# EAGLE design UniAdapter (EAGLE 7.0.0)
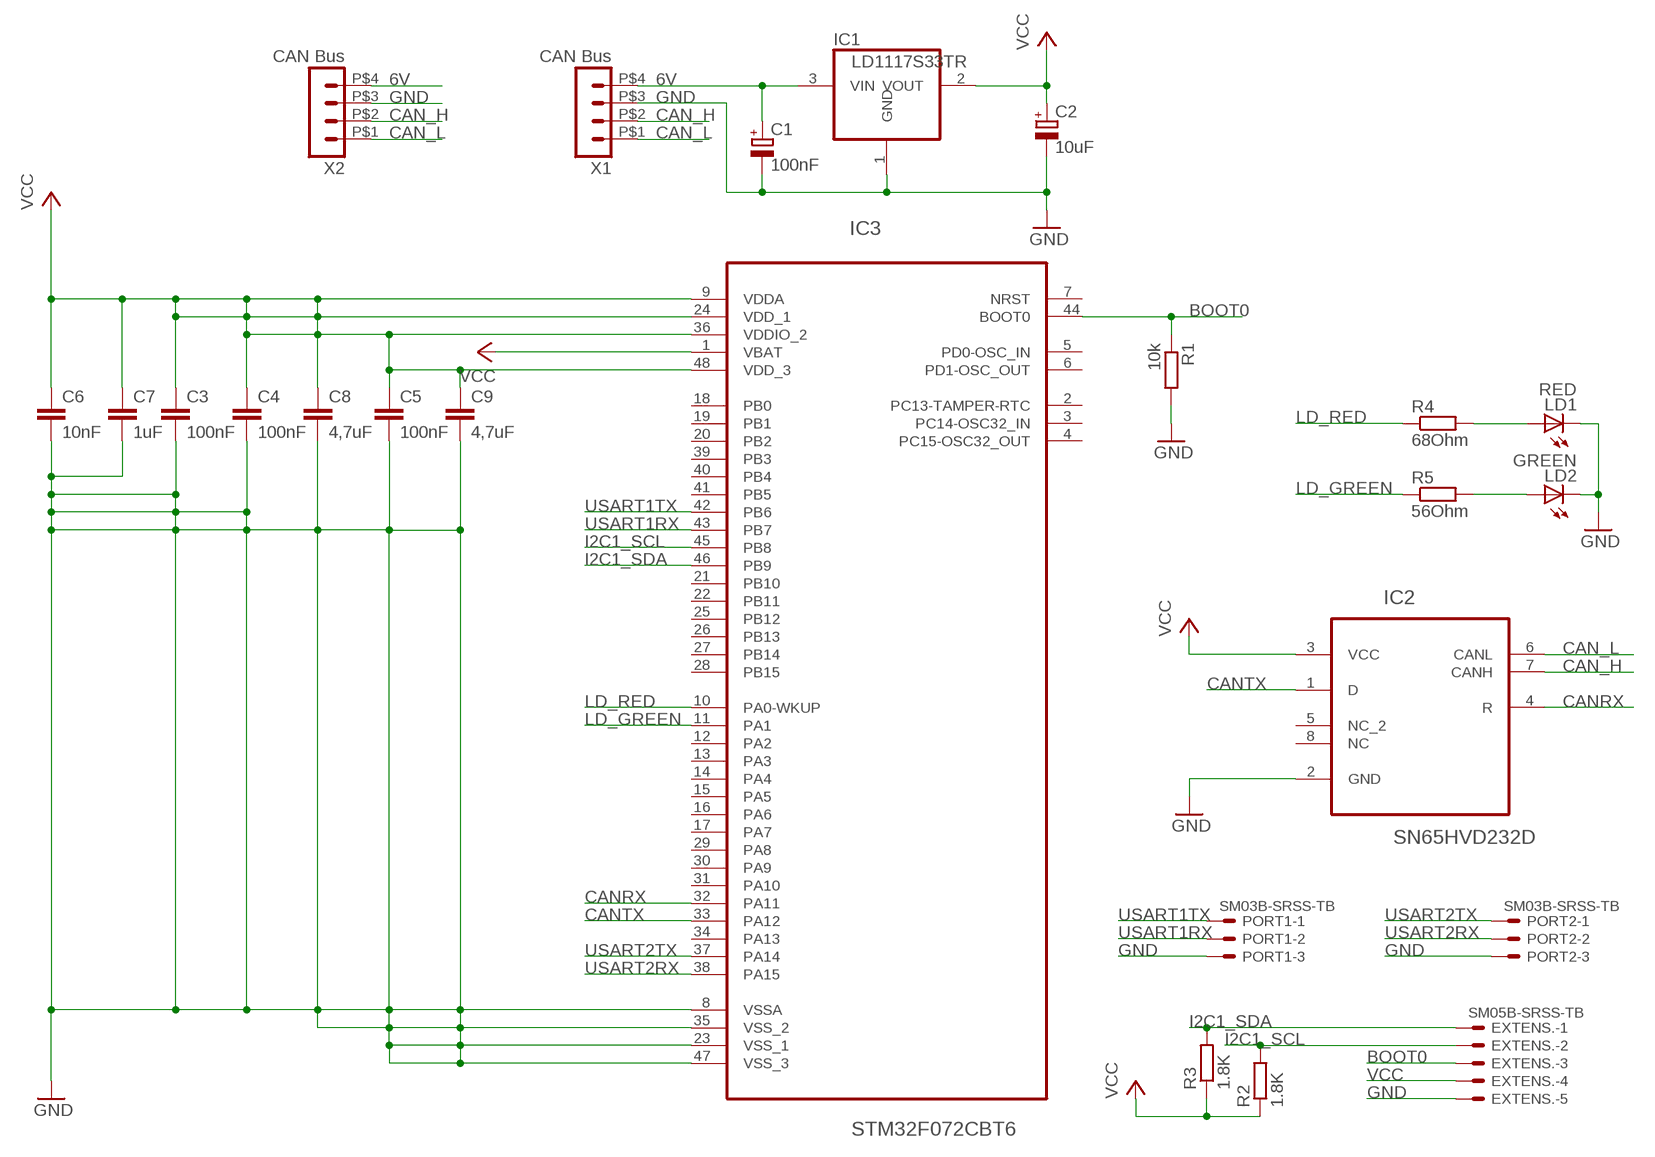
[diagram p0: schematic, sheet 1]

## Parts
C1  100nF  CPOL-EUCT3216  [CT3216]
C2  10uF  CPOL-EUCT3216  [CT3216]
C3  100nF  C-EUC0603  [C0603]
C4  100nF  C-EUC0603  [C0603]
C5  100nF  C-EUC0603  [C0603]
C6  10nF  C-EUC0603  [C0603]
C7  1uF  C-EUC0603  [C0603]
C8  4,7uF  C-EUC0603  [C0603]
C9  4,7uF  C-EUC0603  [C0603]
EXTENS.  SM05B-SRSS-TB  [SM05B-SRSS-TB]
IC1  LD1117S33TR  [SOT223]
IC2  SN65HVD232D  [SOIC127P600X175-8N]
IC3  STM32F072CBT6  [LQFP48]
LD1  RED  LEDCHIPLED_0603  [CHIPLED_0603]
LD2  GREEN  LEDCHIPLED_0603  [CHIPLED_0603]
PORT1  SM03B-SRSS-TB  [SM03B-SRSS-TB]
PORT2  SM03B-SRSS-TB  [SM03B-SRSS-TB]
R1  10k  R-EU_R0603  [R0603]
R2  1.8K  R-EU_R0603  [R0603]
R3  1.8K  R-EU_R0603  [R0603]
R4  68Ohm  R-EU_R0603  [R0603]
R5  56Ohm  R-EU_R0603  [R0603]
X1  CAN Bus  HEADER_POS4_43650-0412  [43650-0412]
X2  CAN Bus  HEADER_POS4_43650-0412  [43650-0412]

## Nets
6V: C1.+ IC1.3(VIN) X1.P$4 X2.P$4
BOOT0: EXTENS..3 IC3.44(BOOT0) R1.1
CAN_H: IC2.7(CANH) X1.P$2 X2.P$2
CAN_L: IC2.6(CANL) X1.P$1 X2.P$1
CANRX: IC2.4(R) IC3.32(PA11)
CANTX: IC2.1(D) IC3.33(PA12)
GND: C1.- C2.- C3.2 C4.2 C5.2 C6.2 C7.2 C8.2 C9.2 EXTENS..5 IC1.1(GND) IC2.2(GND) IC3.8(VSSA) IC3.23(VSS_1) IC3.35(VSS_2) IC3.47(VSS_3) LD1.C LD2.C PORT1.3 PORT2.3 R1.2 X1.P$3 X2.P$3
I2C1_SCL: EXTENS..2 IC3.45(PB8) R2.2
I2C1_SDA: EXTENS..1 IC3.46(PB9) R3.2
LD_GREEN: IC3.11(PA1) R5.1
LD_RED: IC3.10(PA0-WKUP) R4.1
N$3: LD1.A R4.2
N$4: LD2.A R5.2
USART1RX: IC3.43(PB7) PORT1.2
USART1TX: IC3.42(PB6) PORT1.1
USART2RX: IC3.38(PA15) PORT2.2
USART2TX: IC3.37(PA14) PORT2.1
VCC: C2.+ C3.1 C4.1 C5.1 C6.1 C7.1 C8.1 C9.1 EXTENS..4 IC1.2(VOUT) IC2.3(VCC) IC3.1(VBAT) IC3.9(VDDA) IC3.24(VDD_1) IC3.36(VDDIO_2) IC3.48(VDD_3) R2.1 R3.1
Unconnected: IC2.5(NC_2) IC2.8(NC) IC3.2(PC13-TAMPER-RTC) IC3.3(PC14-OSC32_IN) IC3.4(PC15-OSC32_OUT) IC3.5(PD0-OSC_IN) IC3.6(PD1-OSC_OUT) IC3.7(NRST) IC3.12(PA2) IC3.13(PA3) IC3.14(PA4) IC3.15(PA5) IC3.16(PA6) IC3.17(PA7) IC3.18(PB0) IC3.19(PB1) IC3.20(PB2) IC3.21(PB10) IC3.22(PB11) IC3.25(PB12) IC3.26(PB13) IC3.27(PB14) IC3.28(PB15) IC3.29(PA8) IC3.30(PA9) IC3.31(PA10) IC3.34(PA13) IC3.39(PB3) IC3.40(PB4) IC3.41(PB5)

## Library data of the parts
C1 = rcl:CPOL-EU: POLARIZED CAPACITOR, European symbol; OC_FARNELL: 1190132
C2 = rcl:CPOL-EU: POLARIZED CAPACITOR, European symbol; OC_FARNELL: 1432447
C3-C5 = rcl:C-EU: CAPACITOR, European symbol; OC_FARNELL: 1759016
C6 = rcl:C-EU: CAPACITOR, European symbol; OC_FARNELL: 1759022
C7 = rcl:C-EU: CAPACITOR, European symbol; OC_FARNELL: 1759399
C8 C9 = rcl:C-EU: CAPACITOR, European symbol; OC_FARNELL: 2320811
EXTENS. = con-jst2:?M05B-SRSS-TB: Disconnectable Crimp style connector, 1.0mm pitch 5 contacts; OC_FARNELL: 1679121
IC1 = LD1117:LD1117S33TR: 800mA Low Dropout (LDO) Positive Regulator Fixed output voltage of: 3.3V; MF: STMICROELECTRONICS; MPN: REG1117; OC_FARNELL: 1202826; OC_NEWARK: 14P6981
IC2 = texas:SN65HVD232D: 3.3-V CAN TRANSCEIVERS; MPN: SN65HVD232D; OC_FARNELL: 1103107; OC_NEWARK: 35K4890; PACKAGE: SOIC-8; SUPPLIER: Texas Instruments
IC3 = STM32F0:STM32F072CBT6: Entry-level ARM Cortex-M0 MCU with 128 Kbytes Flash, 48 MHz CPU, USB, CAN and CEC functions; MPN: STM32F072CBT6; OC_FARNELL: 2432094; OC_NEWARK: 11N8296; PACKAGE: QFP-48; SUPPLIER: STMICROELECTRONICS
LD1 = led:LED: LED OSRAM: - CHIPLED LG R971, LG N971, LY N971, LG Q971, LY Q971, LO R971, LY R971 LH N974, LH R974 LS Q976, LO Q976, LY Q976 LO Q996 - Hyper CHIPLED LW Q18S LB Q993, LB Q99A, LB R99A - SideLED LS A670, LO A670, LY A670, LG A670, LP A670 LB A673, LV A673, LT A673, LW A673 LH A674 LY A675 LS A676, LA A676, LO A676, LY A676, LW A676 LS A679, LY A679, LG A679 - Hyper Micro SIDELED® LS Y876, LA Y876, LO Y876, LY Y876 LT Y87S - SmartLED LW L88C, LW L88S LB L89C, LB L89S, LG L890 LS L89K, LO L89K, LY L89K LS L896, LA L896, LO L896, LY L896 - TOPLED LS T670, LO T670, LY T670, LG T670, LP T670 LSG T670, LSP T670, LSY T670, LOP T670, LYG T670 LG T671, LOG T671, LSG T671 LB T673, LV T673, LT T673, LW T673 LH T674 LS T676, LA T676, LO T676, LY T676, LB T676, LH T676, LSB T676, LW T676 LB T67C, LV T67C, LT T67C, LS T67K, LO T67K, LY T67K, LW E67C LS E67B, LA E67B, LO E67B, LY E67B, LB E67C, LV E67C, LT E67C LW T67C LS T679, LY T679, LG T679 LS T770, LO T770, LY T770, LG T770, LP T770 LB T773, LV T773, LT T773, LW T773 LH T774 LS E675, LA E675, LY E675, LS T675 LS T776, LA T776, LO T776, LY T776, LB T776 LHGB T686 LT T68C, LB T68C - Hyper Mini TOPLED® LB M676 - Mini TOPLED Santana® LG M470 LS M47K, LO M47K, LY M47K Source: http://www.osram.convergy.de LUXEON: - LUMILED® LXK2-PW12-R00, LXK2-PW12-S00, LXK2-PW14-U00, LXK2-PW14-V00 LXK2-PM12-R00, LXK2-PM12-S00, LXK2-PM14-U00 LXK2-PE12-Q00, LXK2-PE12-R00, LXK2-PE12-S00, LXK2-PE14-T00, LXK2-PE14-U00 LXK2-PB12-K00, LXK2-PB12-L00, LXK2-PB12-M00, LXK2-PB14-N00, LXK2-PB14-P00, LXK2-PB14-Q00 LXK2-PR12-L00, LXK2-PR12-M00, LXK2-PR14-Q00, LXK2-PR14-R00 LXK2-PD12-Q00, LXK2-PD12-R00, LXK2-PD12-S00 LXK2-PH12-R00, LXK2-PH12-S00 LXK2-PL12-P00, LXK2-PL12-Q00, LXK2-PL12-R00 Source: www.luxeon.com KINGBRIGHT: KA-3528ASYC Source: www.kingbright.com; OC_FARNELL: 2099221
LD2 = led:LED: LED OSRAM: - CHIPLED LG R971, LG N971, LY N971, LG Q971, LY Q971, LO R971, LY R971 LH N974, LH R974 LS Q976, LO Q976, LY Q976 LO Q996 - Hyper CHIPLED LW Q18S LB Q993, LB Q99A, LB R99A - SideLED LS A670, LO A670, LY A670, LG A670, LP A670 LB A673, LV A673, LT A673, LW A673 LH A674 LY A675 LS A676, LA A676, LO A676, LY A676, LW A676 LS A679, LY A679, LG A679 - Hyper Micro SIDELED® LS Y876, LA Y876, LO Y876, LY Y876 LT Y87S - SmartLED LW L88C, LW L88S LB L89C, LB L89S, LG L890 LS L89K, LO L89K, LY L89K LS L896, LA L896, LO L896, LY L896 - TOPLED LS T670, LO T670, LY T670, LG T670, LP T670 LSG T670, LSP T670, LSY T670, LOP T670, LYG T670 LG T671, LOG T671, LSG T671 LB T673, LV T673, LT T673, LW T673 LH T674 LS T676, LA T676, LO T676, LY T676, LB T676, LH T676, LSB T676, LW T676 LB T67C, LV T67C, LT T67C, LS T67K, LO T67K, LY T67K, LW E67C LS E67B, LA E67B, LO E67B, LY E67B, LB E67C, LV E67C, LT E67C LW T67C LS T679, LY T679, LG T679 LS T770, LO T770, LY T770, LG T770, LP T770 LB T773, LV T773, LT T773, LW T773 LH T774 LS E675, LA E675, LY E675, LS T675 LS T776, LA T776, LO T776, LY T776, LB T776 LHGB T686 LT T68C, LB T68C - Hyper Mini TOPLED® LB M676 - Mini TOPLED Santana® LG M470 LS M47K, LO M47K, LY M47K Source: http://www.osram.convergy.de LUXEON: - LUMILED® LXK2-PW12-R00, LXK2-PW12-S00, LXK2-PW14-U00, LXK2-PW14-V00 LXK2-PM12-R00, LXK2-PM12-S00, LXK2-PM14-U00 LXK2-PE12-Q00, LXK2-PE12-R00, LXK2-PE12-S00, LXK2-PE14-T00, LXK2-PE14-U00 LXK2-PB12-K00, LXK2-PB12-L00, LXK2-PB12-M00, LXK2-PB14-N00, LXK2-PB14-P00, LXK2-PB14-Q00 LXK2-PR12-L00, LXK2-PR12-M00, LXK2-PR14-Q00, LXK2-PR14-R00 LXK2-PD12-Q00, LXK2-PD12-R00, LXK2-PD12-S00 LXK2-PH12-R00, LXK2-PH12-S00 LXK2-PL12-P00, LXK2-PL12-Q00, LXK2-PL12-R00 Source: www.luxeon.com KINGBRIGHT: KA-3528ASYC Source: www.kingbright.com; OC_FARNELL: 2099223
PORT1 PORT2 = con-jst2:?M03B-SRSS-TB: Disconnectable Crimp style connector, 1.0mm pitch 3 contacts; OC_FARNELL: 1679118
R1 = rcl:R-EU_: RESISTOR, European symbol; OC_FARNELL: 2059627
R2 R3 = rcl:R-EU_: RESISTOR, European symbol; OC_FARNELL: 2059608
R4 = rcl:R-EU_: RESISTOR, European symbol; OC_FARNELL: 2059570
R5 = rcl:R-EU_: RESISTOR, European symbol; OC_FARNELL: 2059568
X1 X2 = con-molex-micro-fit-3_0:HEADER_POS4_?: Molex - Micro-Fit 3.0 Series connector, 3.00mm (0.118") pitch header, 4 positions.; OC_FARNELL: 2060684

## Net classes
0 default: clearance 0.205 mm

## Board
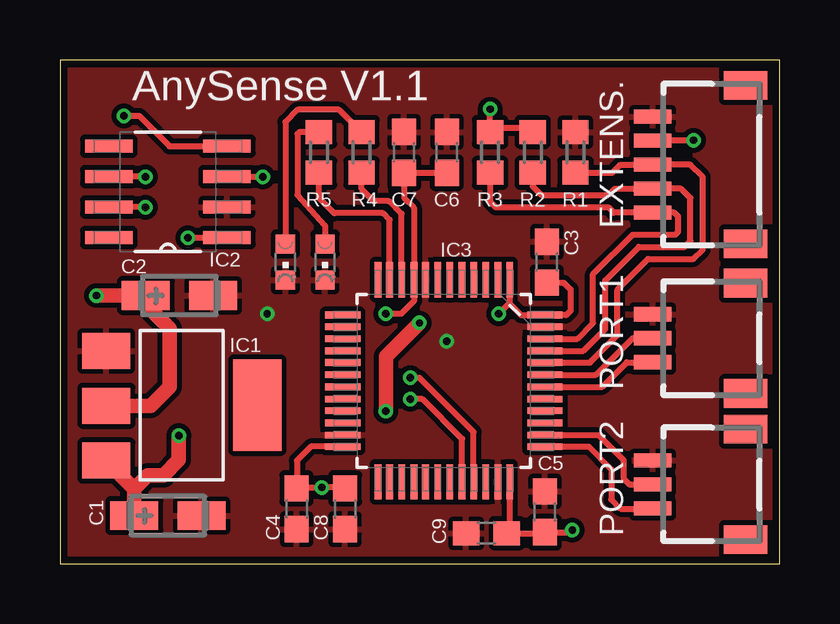
[diagram p1: board, top side]
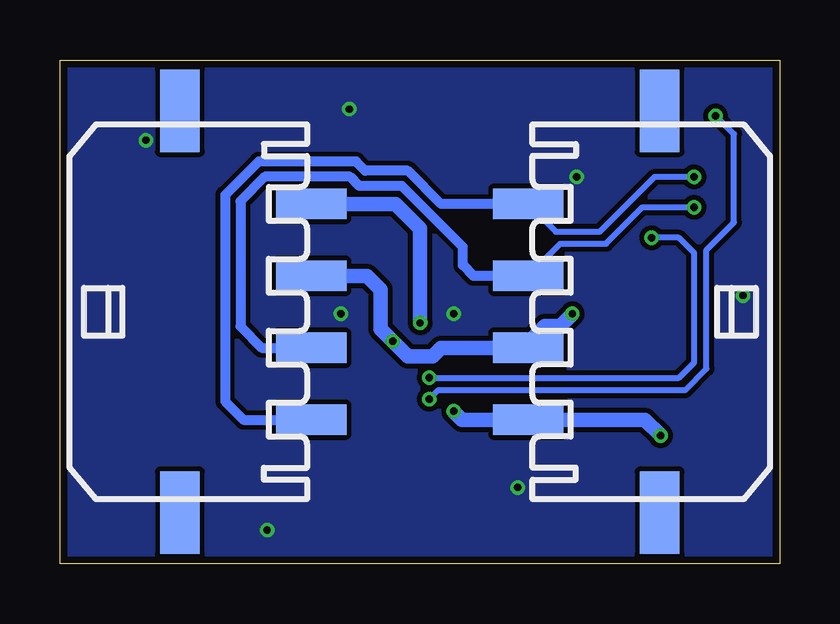
[diagram p2: board, bottom side, seen from below]

Size 30 x 21 mm. Coordinates in mm from the lower left corner, seen from the top.
Outline: 0,0 30,0 30,21 0,21 0,0
Copper layers (1*16): Top 0.035mm / dielectric 1.5mm / Bottom 0.035mm
Design rules "PCB-POOL Standard *": minimum track width 0.15mm, minimum drill 0.3mm, track to track 0.15mm, track to pad 0.15mm, pad to pad 0.15mm, via to via 0.15mm, smd to smd 0.15mm, copper to edge 0.3mm, drill to drill 0.2mm, minimum pad ring 0.2mm, minimum via ring 0.15mm, stop-mask expansion 0.075mm, vias tented up to drill 0mil, thermal gap 0.2mm

### Footprints (pad centres in the part's own frame; a part is rotated, then mirrored left to right if it is on the bottom)
CT3216 = smd 2 x 1.2: + -1.4,0; - 1.4,0
C0603 = smd 1.1 x 1: 1 -0.85,0; 2 0.85,0
SM05B-SRSS-TB = smd 0.6 x 1.55: 1 -2,2.975; 2 -1,2.975; 3 0,2.975; 4 1,2.975; 5 2,2.975 | smd 1.2 x 1.8: FIT@1 -3.3,-0.9; FIT@2 3.3,-0.9
SOT223 = smd 1.499 x 2.007: 1 -2.261,-3.15; 2 0.025,-3.15; 3 2.311,-3.15 | smd 3.81 x 2.007: 4 0,3.15
SOIC127P600X175-8N = smd 1.981 x 0.559: 1 -2.464,1.905; 2 -2.464,0.635; 3 -2.464,-0.635; 4 -2.464,-1.905; 5 2.464,-1.905; 6 2.464,-0.635; 7 2.464,0.635; 8 2.464,1.905
LQFP48 = smd 1.473 x 0.279: 1 -4.216,2.743; 2 -4.216,2.261; 3 -4.216,1.753; 4 -4.216,1.245; 5 -4.216,0.762; 6 -4.216,0.254; 7 -4.216,-0.254; 8 -4.216,-0.762; 9 -4.216,-1.245; 10 -4.216,-1.753; 11 -4.216,-2.261; 12 -4.216,-2.743; 25 4.216,-2.743; 26 4.216,-2.261; 27 4.216,-1.753; 28 4.216,-1.245; 29 4.216,-0.762; 30 4.216,-0.254; 31 4.216,0.254; 32 4.216,0.762; 33 4.216,1.245; 34 4.216,1.753; 35 4.216,2.261; 36 4.216,2.743 | smd 0.279 x 1.473: 13 -2.743,-4.216; 14 -2.261,-4.216; 15 -1.753,-4.216; 16 -1.245,-4.216; 17 -0.762,-4.216; 18 -0.254,-4.216; 19 0.254,-4.216; 20 0.762,-4.216; 21 1.245,-4.216; 22 1.753,-4.216; 23 2.261,-4.216; 24 2.743,-4.216; 37 2.743,4.216; 38 2.261,4.216; 39 1.753,4.216; 40 1.245,4.216; 41 0.762,4.216; 42 0.254,4.216; 43 -0.254,4.216; 44 -0.762,4.216; 45 -1.245,4.216; 46 -1.753,4.216; 47 -2.261,4.216; 48 -2.743,4.216
CHIPLED_0603 = smd 0.8 x 0.8: A 0,-0.75; C 0,0.75
SM03B-SRSS-TB = smd 0.6 x 1.55: 1 -1,2.975; 2 0,2.975; 3 1,2.975 | smd 1.2 x 1.8: FIT@1 -2.3,-0.9; FIT@2 2.3,-0.9
R0603 = smd 1 x 1.1: 1 -0.85,0; 2 0.85,0
43650-0412 = smd 1.27 x 2.92: P$1 4.5,5.48; P$2 1.5,5.48; P$3 -1.5,5.48; P$4 -4.5,5.48 | smd 3.43 x 1.65: TAB1 8.38,0; TAB2 -8.38,0

### Placement (x,y rotation side)
C1  4.5,2 0 top
C2  4.98,11.18 0 top
C3  20.29,12.57 90 top
C4  9.86,2.29 270 top
C5  20.22,2.16 90 top
C6  16.13,17.14 90 top
C7  14.35,17.14 90 top
C8  11.89,2.29 270 top
C9  17.78,1.27 180 top
EXTENS.  27.69,16.64 90 top
IC1  5.08,6.6 270 top
IC2  4.5,15.5 180 top
IC3  16,7.62 270 top
LD1  9.4,12.57 180 top
LD2  11.05,12.57 180 top
PORT1  27.69,9.39 90 top
PORT2  27.69,3.3 90 top
R1  21.49,17.14 90 top
R2  19.71,17.14 270 top
R3  17.93,17.14 270 top
R4  12.57,17.14 90 top
R5  10.79,17.14 90 top
X1  5,10.5 90 bottom
X2  25,10.5 270 bottom

### Tracks (layer width: path | path; a pad name or v marks a point on that pad's centre or on a via)
6V  (via drill 0.3)
  Top 0.61: C1.+ 3.1,3.12 | 3.1,3.12 IC1.3 | v14.99,10.03 13.59,8.64 v13.59,6.35 | 3.1,3.12 3.66,3.68 4.32,3.68 4.95,4.32 v4.95,5.33
  Bottom 0.61: v4.95,5.33 5.62,6 X1.P$4 13.24,6 v13.59,6.35 | v14.99,10.03 14.99,13.97 16.02,15 X2.P$4
BOOT0
  Top 0.254: IC3.44 22.1,8.38 23.24,9.53 23.24,11.43 24.51,12.7 26.42,12.7 26.8,13.08 26.8,16.13 26.29,16.64 EXTENS..3 23.37,16.64 23.03,16.3 R1.1
CAN_H  (via drill 0.3)
  Top 0.254: v3.56,14.86 v3.55,14.87 IC2.7
  Bottom 0.254: X1.P$2 9.14,13.34 7.24,13.34 5.71,14.86 v3.56,14.86
  Bottom 0.406: X1.P$2 12.76,12 13.21,12.45 13.21,13.21 15.75,15.75 17.53,15.75 17.91,16.13 21.46,16.13 22.48,15.11 22.48,9.89 21.59,9 X2.P$2
CAN_L  (via drill 0.3)
  Top 0.254: v3.56,16.13 IC2.6
  Bottom 0.254: X1.P$1 9.32,13.84 7.49,13.84 5.21,16.13 v3.56,16.13
  Bottom 0.406: X1.P$1 14.11,15 15.49,16.38 17.27,16.38 17.65,16.76 21.72,16.76 23.11,15.37 23.11,6.76 22.35,6 X2.P$1
CANRX  (via drill 0.3)
  Top 0.254: IC3.32 16.76,5.21 15.11,6.86 v14.61,6.86 | v2.67,18.67 3.3,18.67 4.57,17.41 IC2.4
  Bottom 0.254: v14.61,6.86 14.22,7.24 3.94,7.24 3.05,8.13 3.05,13.08 1.91,14.22 1.91,17.91 v2.67,18.67
CANTX  (via drill 0.3)
  Top 0.254: IC3.33 17.25,5.49 14.99,7.75 v14.61,7.75 | v5.33,13.59 IC2.1
  Bottom 0.254: v14.61,7.75 4.19,7.75 3.56,8.38 3.56,12.95 4.19,13.59 v5.33,13.59
GND  (via drill 0.3)
  Bottom 0.61: v8.64,10.41 9.14,9.91 9.78,9.91 10.48,9.21 X1.P$3 14.11,9 14.48,8.64 15.49,8.64 v16.13,9.27 16.64,9.78 16.64,11.43 17.21,12 X2.P$3
  pour Top: 0,21 30,21 30,0 0,0
I2C1_SCL
  Top 0.254: IC3.45 21.82,8.87 22.73,9.78 22.73,11.81 24.13,13.21 26.04,13.21 26.29,13.46 26.29,15.24 25.89,15.63 EXTENS..2 23.13,15.63 22.86,15.37 20.07,15.37 19.71,15.72 R2.2
I2C1_SDA
  Top 0.254: IC3.46 21.57,9.37 22.23,10.03 22.23,12.06 23.88,13.72 25.65,13.72 25.78,13.84 25.78,14.48 25.62,14.63 EXTENS..1 23.08,14.63 22.86,14.86 18.16,14.86 17.93,15.09 R3.2
LD_GREEN
  Top 0.254: IC3.11 13.74,14.33 13.46,14.61 11.43,14.61 10.79,15.24 R5.1
LD_RED
  Top 0.254: IC3.10 14.25,14.58 13.72,15.11 13.08,15.11 12.57,15.62 R4.1
N$3
  Top 0.254: R4.2 11.64,18.92 9.91,18.92 9.4,18.41 LD1.A
N$4
  Top 0.254: R5.2 9.99,18 9.91,17.91 9.91,15.37 11.05,14.1 LD2.A
USART1RX
  Top 0.254: IC3.43 22.35,7.87 23.87,9.39 PORT1.2
USART1TX
  Top 0.254: IC3.42 22.61,7.37 23.63,8.39 PORT1.1
USART2RX
  Top 0.254: IC3.38 22.45,5.36 23.5,4.32 23.5,3.56 23.75,3.3 PORT2.2
USART2TX
  Top 0.254: IC3.37 22.05,4.88 22.99,3.94 22.99,2.67 23.37,2.29 24.7,2.29 PORT2.1
VCC  (via drill 0.3, 0.3 pad 0.36)
  Top 0.254: IC3.24 10.46,4.88 9.88,4.29 9.91,3.06 C4.1 9.9,3.17 v10.92,3.17 11.85,3.17 C8.1 | EXTENS..4 24.73,17.65 v26.42,17.65 | v18.29,10.41 18.75,10.87 IC3.1 18.75,10.85 19.23,10.36 IC3.48 21.11,10.36 21.29,10.54 21.29,11.43 21,11.72 C3.1 | R2.1 19.29,18.16 17.87,18.16 R3.1 v17.93,18.95 | IC2.3 8.26,16.14 v8.46,16.13 | v13.59,10.41 14.22,10.41 14.76,10.95 IC3.9 14.76,14.83 14.35,15.24 C7.1 C6.1 | IC3.36 18.75,1.39 C9.1 20.31,1.27 C5.1 21.27,1.31 v21.36,1.4
  Top 0.61: IC1.2 3.79,6.58 4.57,7.37 4.57,9.8 3.58,10.79 C2.+ v1.52,11.18
  pour Bottom (no thermals): 0,21 30,21 30,0 0,0

### Text on the board
tNames: AnySense V1.1
_tNames: C1 | UPDATE | C5 | S.PORT | IC1 | C2 | R2 | R1 | IC2 | C6 | U$1 | C4 | C3 | C7